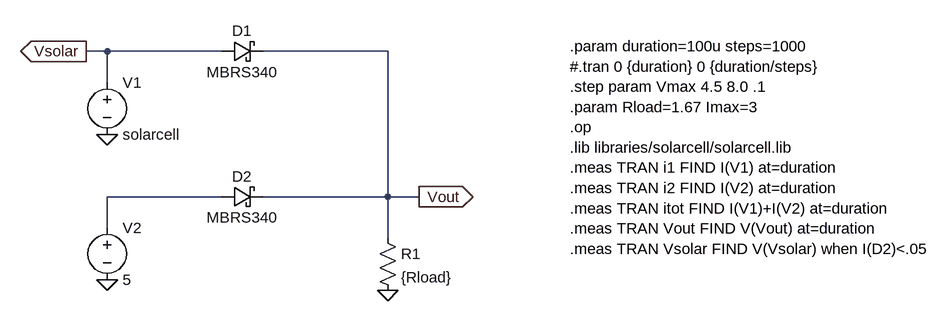
[diagram p0: schematic parallel_source.asc]
parallel_source.asc, the LTspice schematic file:
Version 4
SHEET 1 1672 680
WIRE 160 96 128 96
WIRE 336 96 160 96
WIRE 592 96 400 96
WIRE 160 144 160 96
WIRE 336 320 160 320
WIRE 592 320 592 96
WIRE 592 320 400 320
WIRE 640 320 592 320
WIRE 160 368 160 320
WIRE 592 384 592 320
FLAG 160 448 0
FLAG 160 224 0
FLAG 592 464 0
FLAG 640 320 Vout
IOPIN 640 320 Out
FLAG 128 96 Vsolar
IOPIN 128 96 Out
SYMBOL Voltage 160 128 R0
SYMATTR InstName V1
SYMATTR Value solarcell
SYMATTR Prefix X
SYMATTR SpiceLine Imax={Imax}, Vmax={Vmax}
SYMBOL Voltage 160 352 R0
SYMATTR InstName V2
SYMATTR Value 5
SYMBOL schottky 336 112 R270
WINDOW 0 32 32 VTop 2
WINDOW 3 0 32 VBottom 2
SYMATTR InstName D1
SYMATTR Value MBRS340
SYMATTR Description Diode
SYMATTR Type diode
SYMBOL schottky 336 336 R270
WINDOW 0 32 32 VTop 2
WINDOW 3 0 32 VBottom 2
SYMATTR InstName D2
SYMATTR Value MBRS340
SYMATTR Description Diode
SYMATTR Type diode
SYMBOL Res 576 368 R0
SYMATTR InstName R1
SYMATTR Value {Rload}
TEXT 872 88 Left 2 !.param duration=100u steps=1000\n#.tran 0 {duration} 0 {duration/steps}\n.step param Vmax 4.5 8.0 .1\n.param Rload=1.67 Imax=3\n.op\n.lib libraries/solarcell/solarcell.lib\n.meas TRAN i1 FIND I(V1) at=duration\n.meas TRAN i2 FIND I(V2) at=duration\n.meas TRAN itot FIND I(V1)+I(V2) at=duration\n.meas TRAN Vout FIND V(Vout) at=duration\n.meas TRAN Vsolar FIND V(Vsolar) when I(D2)<.05

The netlist it stands for:
* parallel_source.asc
XV1 Vsolar 0 solarcell Imax={Imax}, Vmax={Vmax}  ; pins + -
V2 N001 0 5
D1 Vsolar Vout MBRS340
D2 N001 Vout MBRS340
R1 Vout 0 {Rload}
.model D D
.lib standard.dio
.param duration=100u steps=1000
#.tran 0 {duration} 0 {duration/steps}
.step param Vmax 4.5 8.0 .1
.param Rload=1.67 Imax=3
.op
.lib libraries/solarcell/solarcell.lib
.meas TRAN i1 FIND I(V1) at=duration
.meas TRAN i2 FIND I(V2) at=duration
.meas TRAN itot FIND I(V1)+I(V2) at=duration
.meas TRAN Vout FIND V(Vout) at=duration
.meas TRAN Vsolar FIND V(Vsolar) when I(D2)<.05
.backanno
.end